# EAGLE schematic riffle-base-simple (EAGLE 6.5.0)
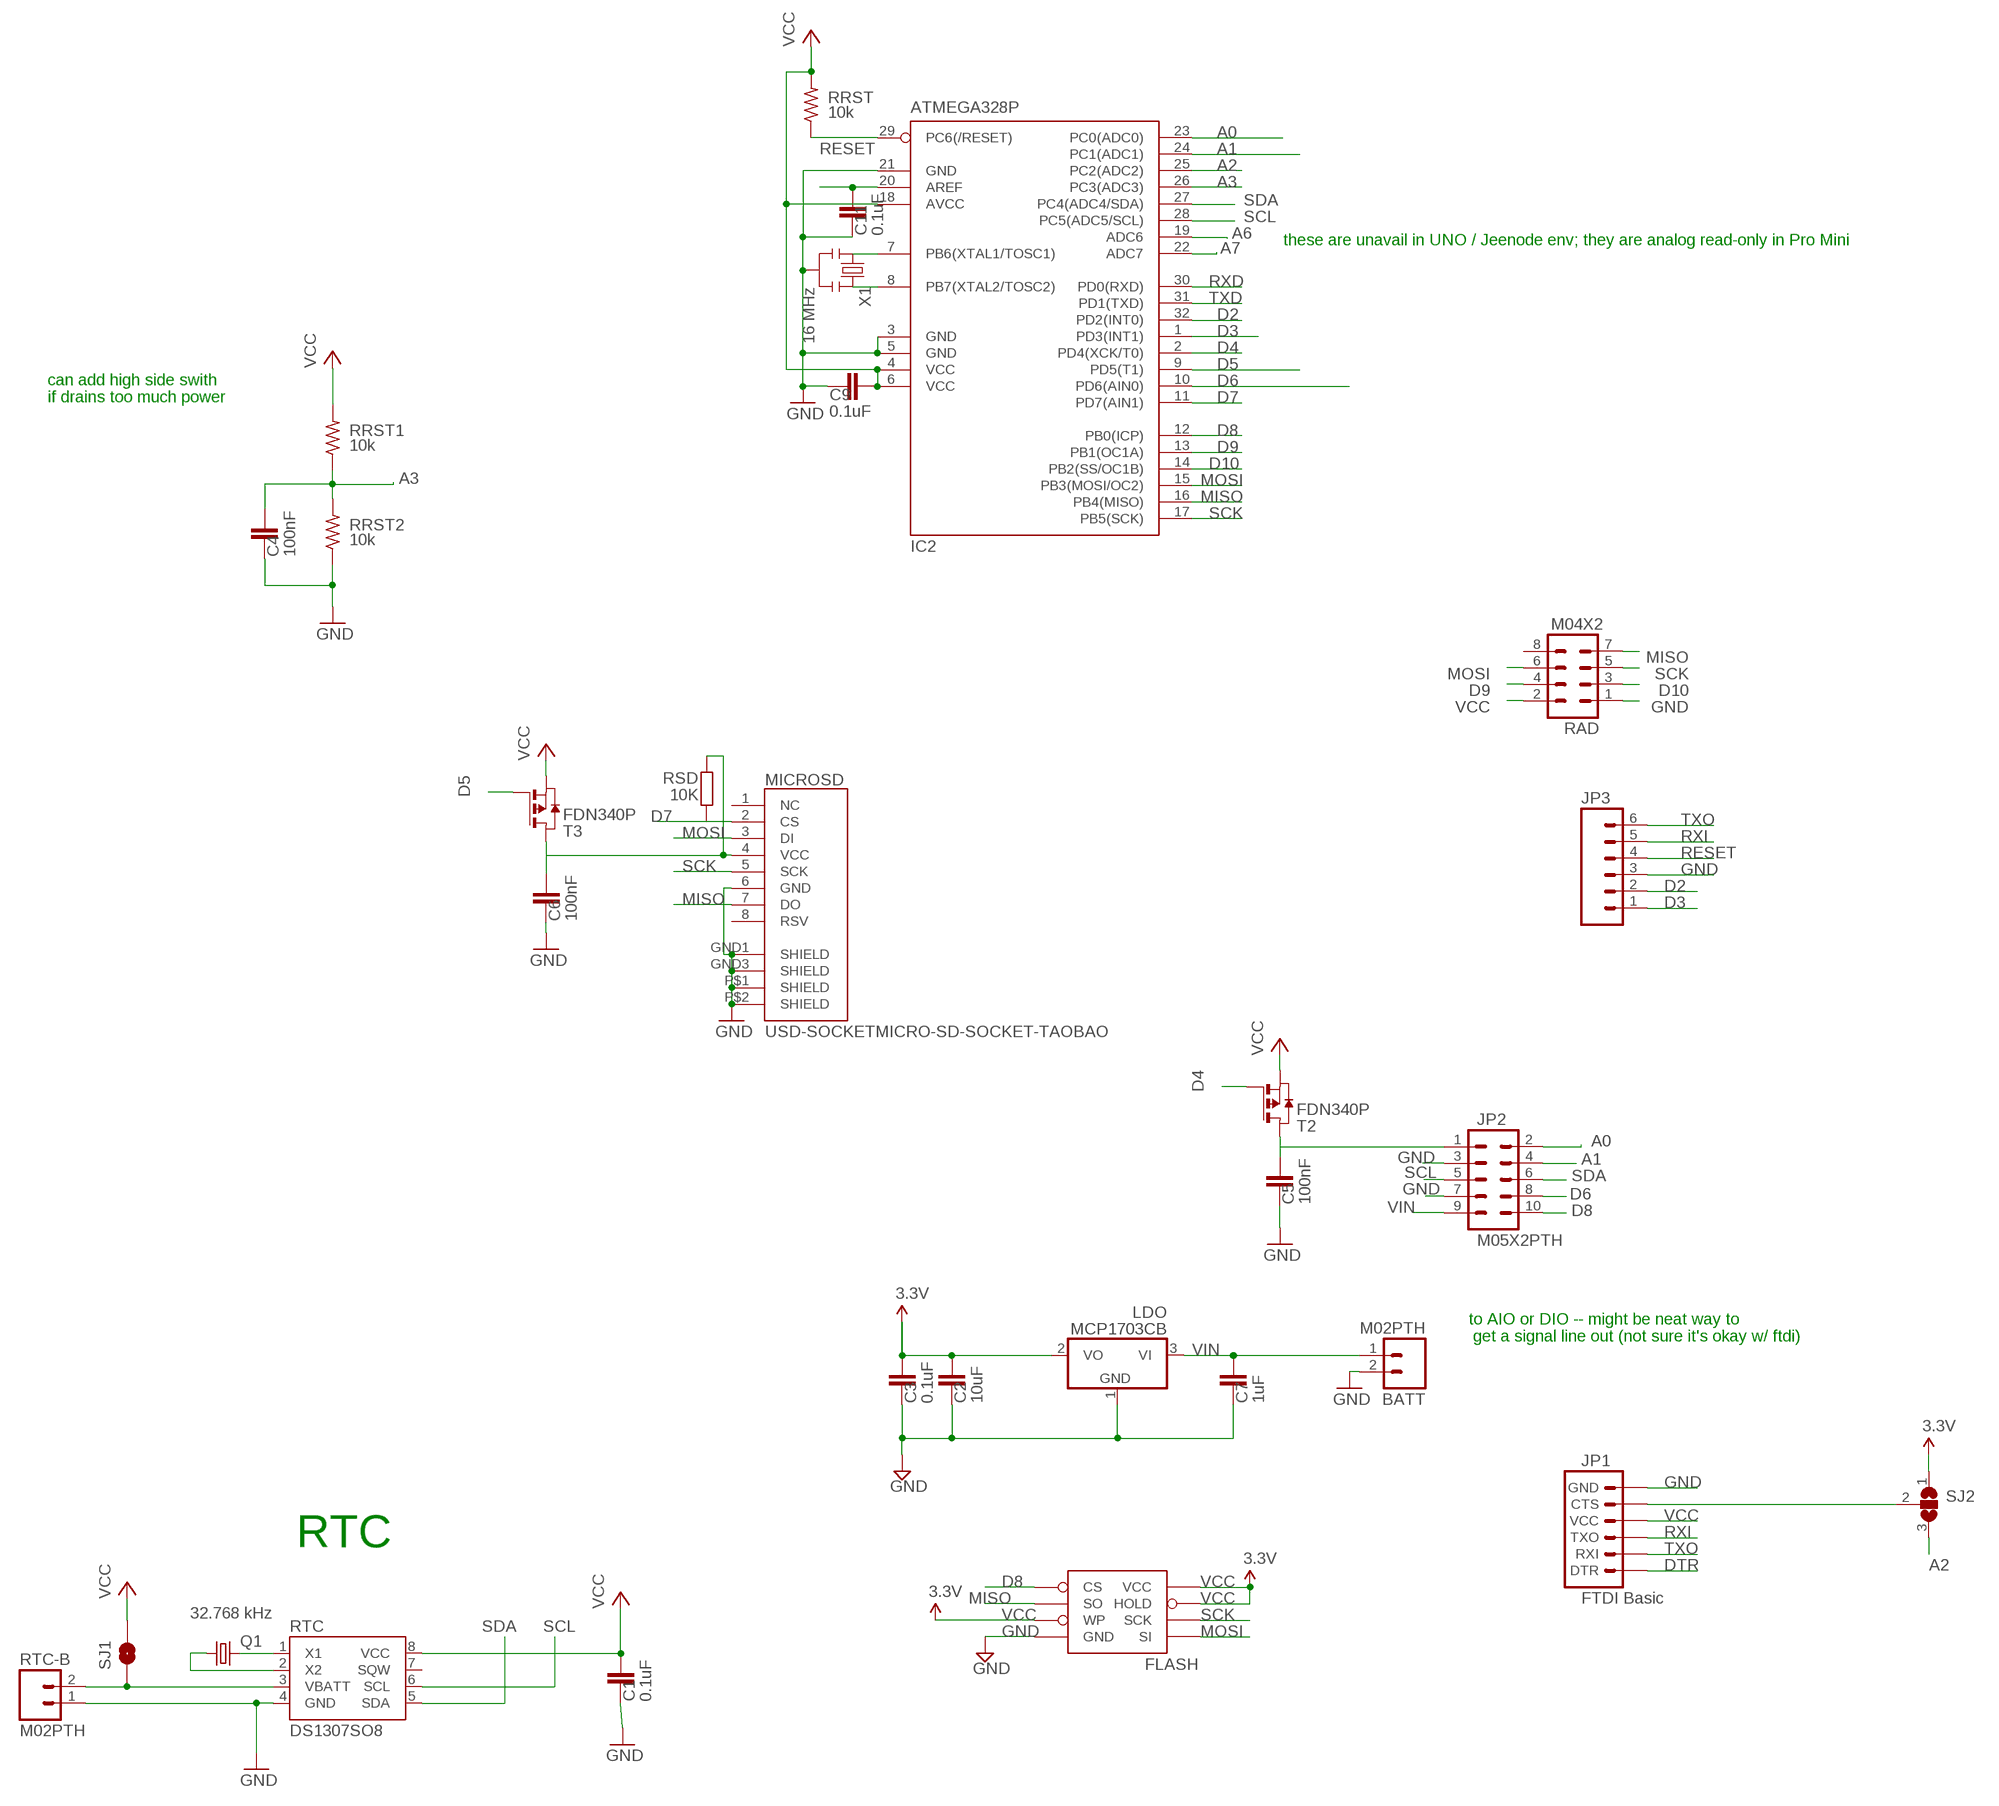
[diagram p0: schematic, sheet 1]

## Parts
BATT  M02PTH  [1X02]
C1  0.1uF  C-EUC0805  [C0805]
C2  10uF  C-EUC0805  [C0805]
C3  0.1uF  C-EUC0805  [C0805]
C4  100nF  C-EUC0805  [C0805]
C5  100nF  C-EUC0805  [C0805]
C6  100nF  C-EUC0805  [C0805]
C7  1uF  C-EUC0805  [C0805]
C9  0.1uF  C-EUC0805  [C0805]
C11  0.1uF  C-EUC0805  [C0805]
FLASH  AT25F512BWIDE_5.3MM  [SO08WIDE]
IC2  ATMEGA328P  MEGA8-AI  [TQFP32-08]
JP1  FTDI Basic  ARDUINO_SERIAL_PROGRAMPTH  [1X06]
JP2  M05X2PTH  [AVR_ICSP]
JP3  M06LOCK  [1X06_LOCK]
LDO  MCP1703CB  [SOT23]
MICROSD  USD-SOCKETMICRO-SD-SOCKET-TAOBAO  [MICRO-SD-SOCKET-TAOBAO]
Q1  32.768 kHz  CRYSTALTC26H  [TC26H]
RAD  M04X2  [2X4]
RRST  10k  R-US_R0805  [R0805@1]
RRST1  10k  R-US_R0805  [R0805@1]
RRST2  10k  R-US_R0805  [R0805@1]
RSD  10K  R-EU_R0805  [R0805]
RTC  DS1307SO8  [SO08]
RTC-B  M02PTH  [1X02]
SJ1  SOLDERJUMPERTRACE  [SJ_2S-TRACE]
SJ2  SJ2W  [SJ_2]
T2  FDN340P  PMOSSOT23  [SOT-23]
T3  FDN340P  PMOSSOT23  [SOT-23]
X1  16 MHz  RESONATORSMD  [RESONATOR-SMD]

## Nets
A0: IC2.23(PC0(ADC0)) JP2.2
A1: IC2.24(PC1(ADC1)) JP2.4
A2: IC2.25(PC2(ADC2)) SJ2.3
A3: C4.2 IC2.26(PC3(ADC3)) RRST1.1 RRST2.2
A6: IC2.19(ADC6)
A7: IC2.22(ADC7)
AREF: C11.2 IC2.20(AREF)
D2: IC2.32(PD2(INT0)) JP3.2
D3: IC2.1(PD3(INT1)) JP3.1
D4: IC2.2(PD4(XCK/T0)) T2.3(G)
D5: IC2.9(PD5(T1)) T3.3(G)
D6: IC2.10(PD6(AIN0)) JP2.8
D7: IC2.11(PD7(AIN1)) MICROSD.2(CS) RSD.1
D8: FLASH.1(CS) IC2.12(PB0(ICP)) JP2.10
D9: IC2.13(PB1(OC1A)) RAD.4
D10: IC2.14(PB2(SS/OC1B)) RAD.3
DTR: JP1.1(DTR)
GND [power]: BATT.2 C1.1 C2.1 C3.1 C4.1 C5.1 C6.1 C7.1 C9.1 C11.1 FLASH.4(GND) IC2.3(GND) IC2.5(GND) IC2.21(GND) JP1.6(GND) JP2.3 JP2.7 JP3.3 LDO.1(GND) MICROSD.6(GND) MICROSD.GND1(SHIELD) MICROSD.GND3(SHIELD) MICROSD.P$1(SHIELD) MICROSD.P$2(SHIELD) RAD.1 RRST2.1 RTC-B.1 RTC.4(GND) X1.2
MISO: FLASH.2(SO) IC2.16(PB4(MISO)) MICROSD.7(DO) RAD.7
MOSI: FLASH.5(SI) IC2.15(PB3(MOSI/OC2)) MICROSD.3(DI) RAD.6
N$1: RTC-B.2 RTC.3(VBATT) SJ1.1
N$2: IC2.8(PB7(XTAL2/TOSC2)) X1.3
N$3: JP1.5(CTS) SJ2.2
N$4: C5.2 JP2.1 T2.1(D)
N$5: IC2.7(PB6(XTAL1/TOSC1)) X1.1
N$15: Q1.2 RTC.1(X1)
N$16: Q1.1 RTC.2(X2)
N$31: C6.2 MICROSD.4(VCC) RSD.2 T3.1(D)
RESET: IC2.29(PC6(/RESET)) JP3.4 RRST.1
RXD: IC2.30(PD0(RXD))
RXI: JP1.3(TXO) JP3.5
SCK: FLASH.6(SCK) IC2.17(PB5(SCK)) MICROSD.5(SCK) RAD.5
SCL: IC2.28(PC5(ADC5/SCL)) JP2.5 RTC.6(SCL)
SDA: IC2.27(PC4(ADC4/SDA)) JP2.6 RTC.5(SDA)
TXD: IC2.31(PD1(TXD))
TXO: JP1.2(RXI) JP3.6
VCC: C1.2 C2.2 C3.2 C9.2 FLASH.3(WP) FLASH.7(HOLD) FLASH.8(VCC) IC2.4(VCC) IC2.6(VCC) IC2.18(AVCC) JP1.4(VCC) LDO.2(VO) RAD.2 RRST1.2 RRST.2 RTC.8(VCC) SJ1.2 SJ2.1 T2.2(S) T3.2(S) ; supply symbol labelled 3.3V
VIN [power]: BATT.1 C7.2 JP2.9 LDO.3(VI)
Unconnected: MICROSD.1(NC) MICROSD.8(RSV) RAD.8 RTC.7(SQW)

## Notes on the sheet
- these are unavail in UNO / Jeenode env; they are analog read-only in Pro Mini
- can add high side swith
  if drains too much power
- to AIO or DIO -- might be neat way to
   get a signal line out (not sure it's okay w/ ftdi)
- RTC

## Library data of the parts
BATT RTC-B = SparkFun-Connectors:M02: Standard 2-pin 0.1" header. Use with - straight break away headers ( PRT-00116) - right angle break away headers (PRT-00553) - swiss pins (PRT-00743) - machine pins (PRT-00117) - female headers (PRT-00115) Molex polarized connector foot print use with: PRT-08233 with associated crimp pins and housings. 2.54_SCREWTERM for use with PRT-10571. 3.5mm Screw Terminal footprints for PRT-08084 5mm Screw Terminal footprints for use with PRT-08433
C1-C7 C9 C11 = rcl:C-EU: CAPACITOR, European symbol
FLASH = LowPowerLab:AT25F512B: 4-Mbit SPI flash memory
IC2 = atmel:MEGA8: MICROCONTROLLER 8 Kbytes FLASH, 1 kbytes SRAM, 512 bytes EEPROM, USART, 6-channel 10 bit ADC, 2-channel 8 bit ADC Pin compatible with Atmega48, ATMega88, ATMega168 Source: avr.lbr; MPN: ATMEGA8-16AU; OC_FARNELL: 9171371; OC_NEWARK: 73M8863
JP1 = SparkFun:ARDUINO_SERIAL_PROGRAM
JP2 = SparkFun-Connectors:M05X2: Header 5x2 Standard 10-pin dual row 0.1" header. Commonly used with AVR-ISP. Use with Spark Fun Electronics SKU: PRT-00778
JP3 = SparkFun-Connectors:M06: Header 6 Standard 6-pin 0.1" header. Use with straight break away headers (SKU : PRT-00116), right angle break away headers (PRT-00553), swiss pins (PRT-00743), machine pins (PRT-00117), and female headers (PRT-00115). Molex polarized connector foot print use with SKU : PRT-08094 with associated crimp pins and housings. NOTES ON THE VARIANTS LOCK and LOCK_LONGPADS... This footprint was designed to help hold the alignment of a through-hole component (i.e. 6-pin header) while soldering it into place. You may notice that each hole has been shifted either up or down by 0.005 of an inch from it's more standard position (which is a perfectly straight line). This slight alteration caused the pins (the squares in the middle) to touch the edges of the holes. Because they are alternating, it causes a "brace" to hold the component in place. 0.005 has proven to be the perfect amount of "off-center" position when using our standard breakaway headers. Although looks a little odd when you look at the bare footprint, once you have a header in there, the alteration is very hard to notice. Also,if you push a header all the way into place, it is covered up entirely on the bottom side. This idea of altering the position of holes to aid alignment will be further integrated into the Sparkfun Library for other footprints. It can help hold any component with 3 or more connection pins.
LDO = linear:MCP1703: 250 mA, 16V, Low Quiescent Current LDO Regulator Source: http://ww1.microchip.com/downloads/en/DeviceDoc/22049b.pdf
MICROSD = SparkFunNew:USD-SOCKET: microSD Socket Push-push type uSD socket. Schematic element and footprint production proven. Spark Fun Electronics SKU : PRT-00127. tDoc lines correctly indicate media card edge positions when inserting (unlocked, locked, depressed).
Q1 = SparkFun:CRYSTAL: Crystals Various standard crystals. Proven footprints. Spark Fun Electronics SKU : COM-00534
RAD = SparkFun-Connectors:M04X2: .1" header, two rows of four.
RRST RRST1 RRST2 = rcl:R-US_: RESISTOR, American symbol
RSD = rcl:R-EU_: RESISTOR, European symbol
RTC = SparkFun:DS1307
SJ1 = SparkFun:SOLDERJUMPER: Solder Jumper Standard SMD solder jumper. Used to automate production. Two varients : Normally Open and Normally Closed are the same, but have different paste layers. NC will have a large amount of paste and should jumper during reflow.
SJ2 = jumper:SJ2W: SMD solder JUMPER
T2 T3 = zetex:PMOSSOT23: MOS FET
X1 = SparkFun:RESONATOR: Resonator Small SMD resonator. This is the itty bitty 10/20MHz resonators with built in caps. CSTCE10M0G55 and CSTCE20M0V53. Footprint has been reviewed closely but hasn't been tested yet.

## Net classes
1 power: width 0.381 mm, clearance 0.254 mm